# EAGLE design stm32F1_dev_schematic (EAGLE 9.6.2)
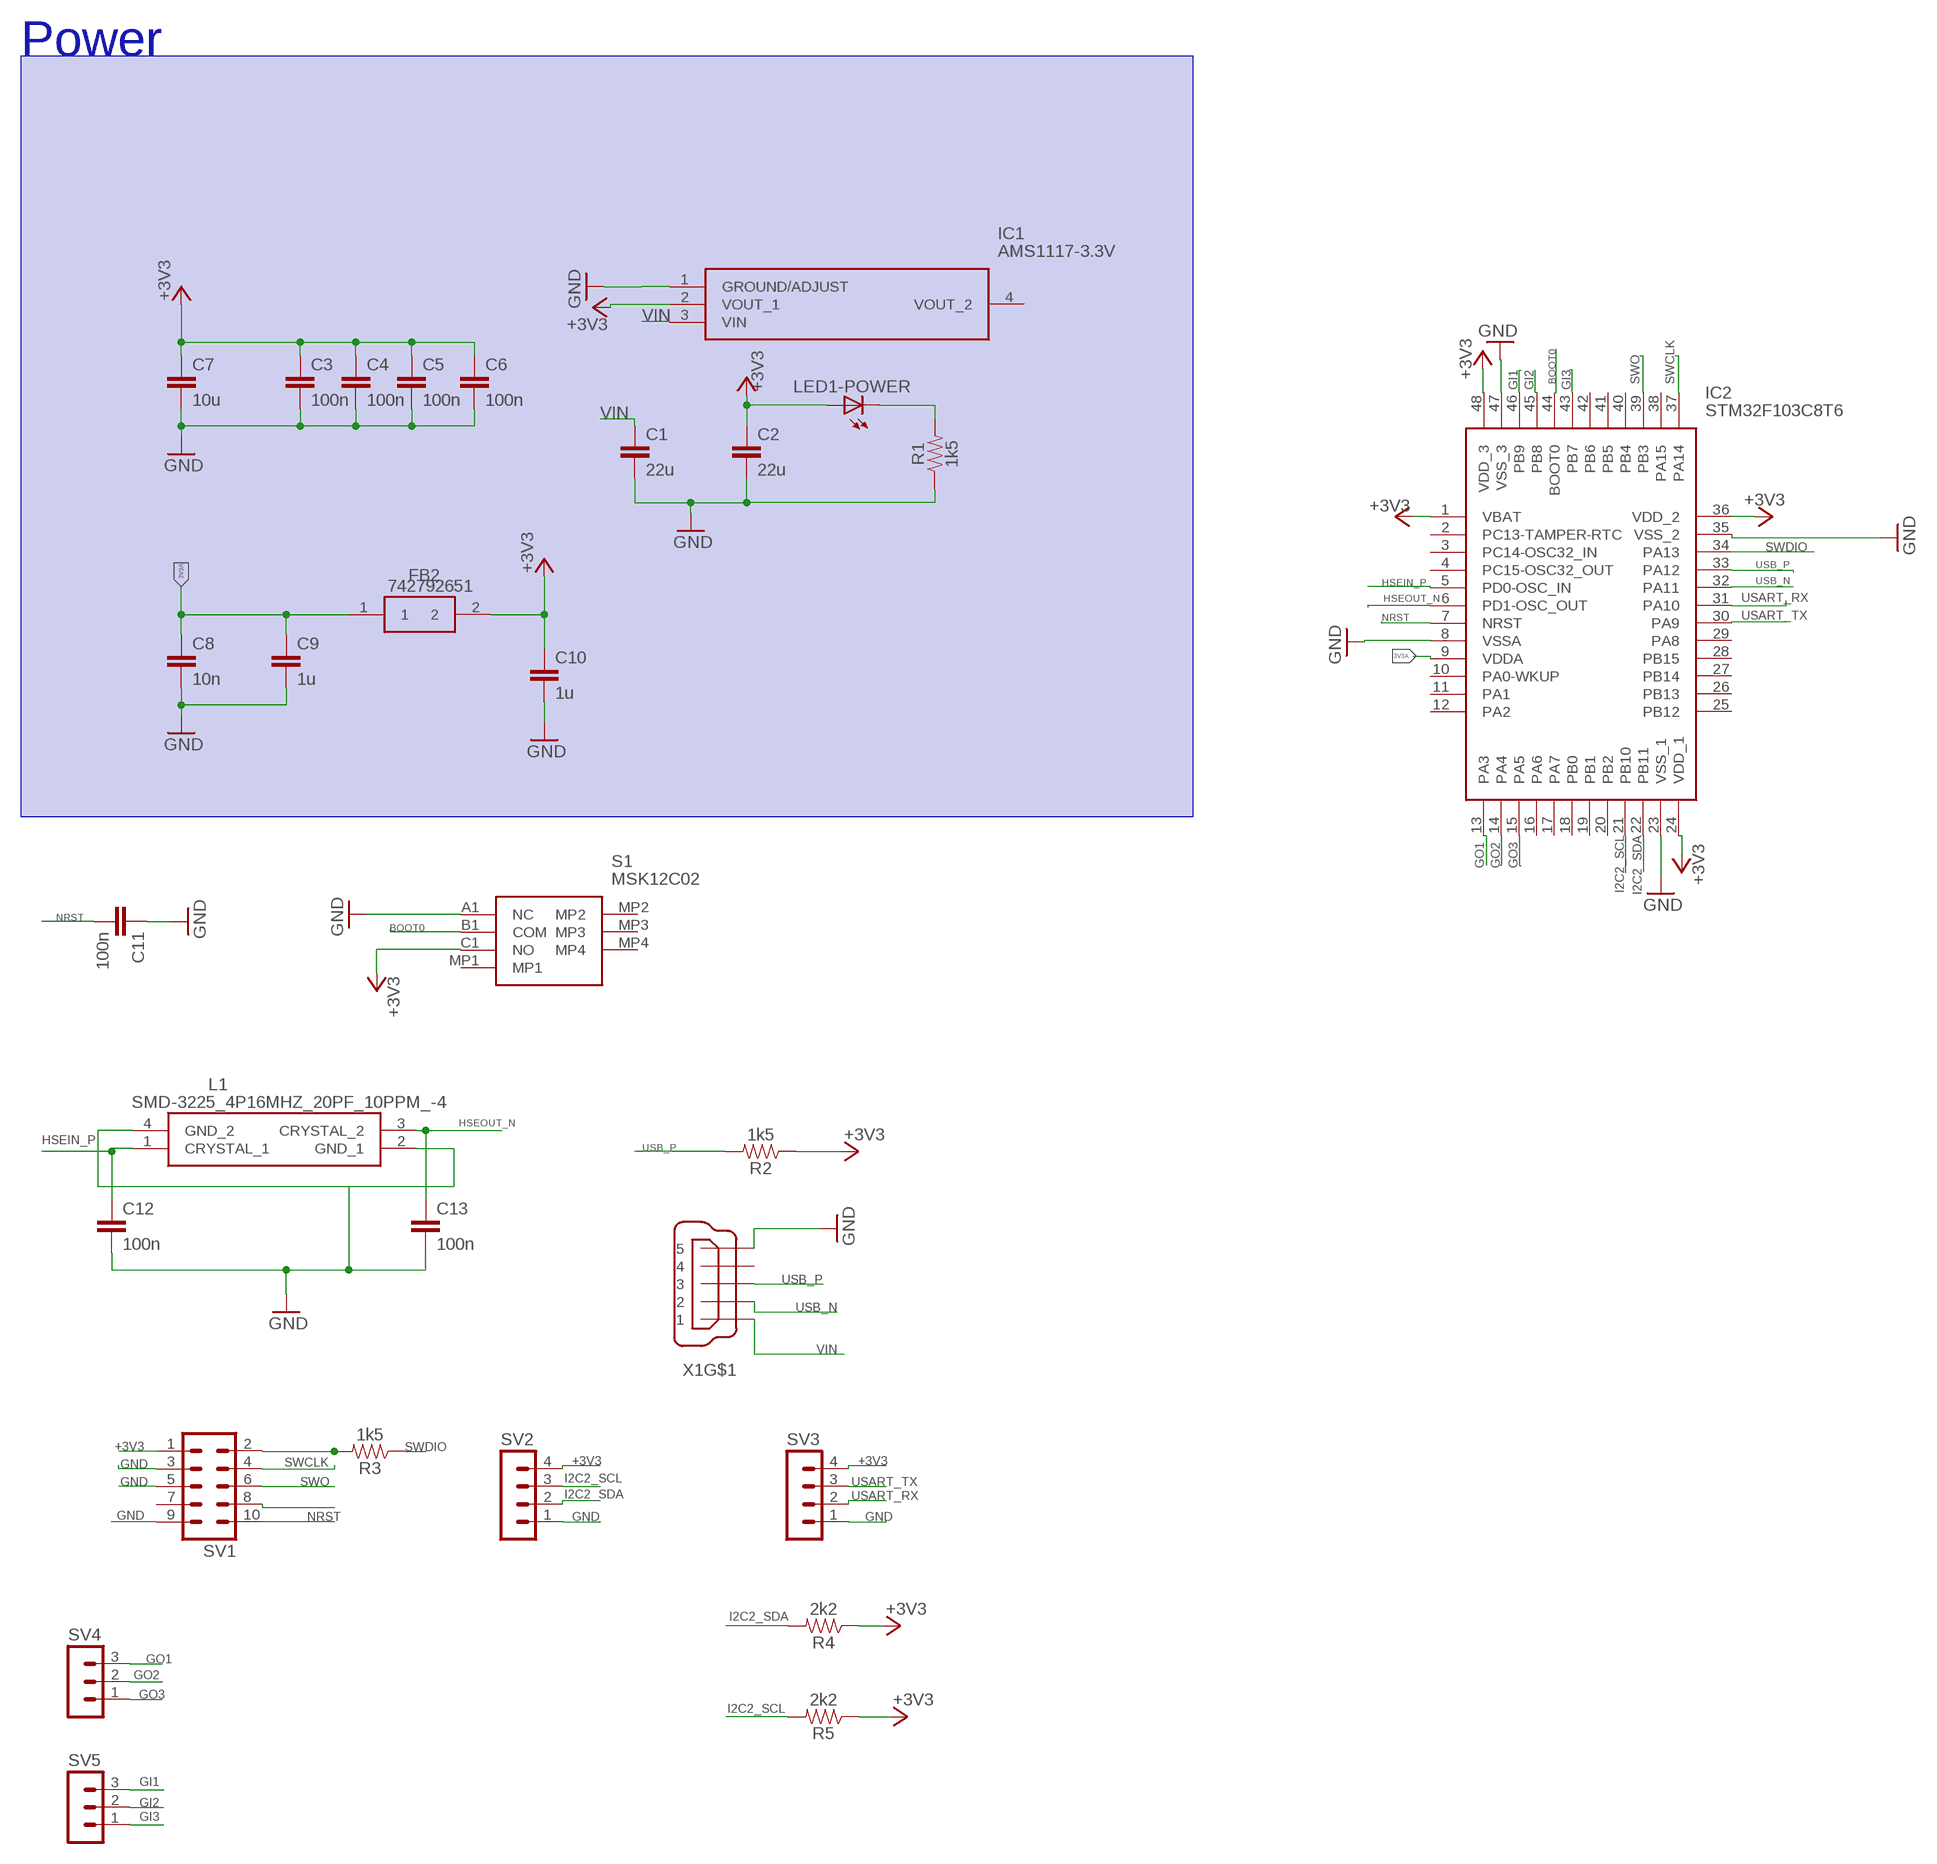
[diagram p0: schematic, sheet 1]

## Parts
C1  22u  1.0UF-0805-25V-(+80/-20%)  [0805]
C2  22u  1.0UF-0805-25V-(+80/-20%)  [0805]
C3  100n  1.0UF-0805-25V-(+80/-20%)  [0805]
C4  100n  1.0UF-0805-25V-(+80/-20%)  [0805]
C5  100n  1.0UF-0805-25V-(+80/-20%)  [0805]
C6  100n  1.0UF-0805-25V-(+80/-20%)  [0805]
C7  10u  1.0UF-0805-25V-(+80/-20%)  [0805]
C8  10n  1.0UF-0805-25V-(+80/-20%)  [0805]
C9  1u  1.0UF-0805-25V-(+80/-20%)  [0805]
C10  1u  1.0UF-0805-25V-(+80/-20%)  [0805]
C11  100n  1.0UF-0805-25V-(+80/-20%)  [0805]
C12  100n  1.0UF-0805-25V-(+80/-20%)  [0805]
C13  100n  1.0UF-0805-25V-(+80/-20%)  [0805]
FB2  742792651  [BEADC1608X100N]
IC1  AMS1117-3.3V  [SOT229P700X180-4N]
IC2  STM32F103C8T6  [QFP50P900X900X160-48N]
L1  SMD-3225_4P16MHZ_20PF_10PPM_-4  [SMD3225_4P16MHZ20PF10PPM4085]
LED1-POWER  LEDCHIPLED_0603  [CHIPLED_0603]
R1  1k5  0.22OHM-0805-1/4W-1%  [0805]
R2  1k5  0.22OHM-0805-1/4W-1%  [0805]
R3  1k5  0.22OHM-0805-1/4W-1%  [0805]
R4  2k2  0.22OHM-0805-1/4W-1%  [0805]
R5  2k2  0.22OHM-0805-1/4W-1%  [0805]
S1  MSK12C02  [MSK12C02]
SV1  MA05-2  [MA05-2]
SV2  MA04-1  [MA04-1]
SV3  MA04-1  [MA04-1]
SV4  MA03-1  [MA03-1]
SV5  MA03-1  [MA03-1]
X1  MINI-USB-SCHIELD-32005-301  [32005-301]

## Nets
3V3A: C8.1 C9.1 FB2.1 IC2.9(VDDA)
+3V3 [3v3]: C2.1 C3.1 C4.1 C5.1 C6.1 C7.1 C10.1 FB2.2 IC1.2(VOUT_1) IC2.1(VBAT) IC2.24(VDD_1) IC2.36(VDD_2) IC2.48(VDD_3) LED1-POWER.A R2.1 R4.1 R5.1 S1.C1(NO) SV1.1 SV2.4 SV3.4
BOOT0: IC2.44(BOOT0) S1.B1(COM)
GI1: IC2.46(PB9) SV5.3
GI2: IC2.45(PB8) SV5.2
GI3: IC2.43(PB7) SV5.1
GND: C1.2 C2.2 C3.2 C4.2 C5.2 C6.2 C7.2 C8.2 C9.2 C10.2 C11.1 C12.2 C13.2 IC1.1(GROUND/ADJUST) IC2.8(VSSA) IC2.23(VSS_1) IC2.35(VSS_2) IC2.47(VSS_3) L1.2(GND_1) L1.4(GND_2) R1.1 S1.A1(NC) SV1.3 SV1.5 SV1.9 SV2.1 SV3.1 X1.5
GO1: IC2.13(PA3) SV4.3
GO2: IC2.14(PA4) SV4.2
GO3: IC2.15(PA5) SV4.1
HSEIN_P: C12.1 IC2.5(PD0-OSC_IN) L1.1(CRYSTAL_1)
HSEOUT_N: C13.1 IC2.6(PD1-OSC_OUT) L1.3(CRYSTAL_2)
I2C2_SCL: IC2.21(PB10) R5.2 SV2.3
I2C2_SDA: IC2.22(PB11) R4.2 SV2.2
N$1: LED1-POWER.C R1.2
N$3: R3.2 SV1.2
N$6: SV1.8
NRST: C11.2 IC2.7(NRST) SV1.10
SWCLK: IC2.37(PA14) SV1.4
SWDIO: IC2.34(PA13) R3.1
SWO: IC2.39(PB3) SV1.6
USART_RX: IC2.31(PA10) SV3.2
USART_TX: IC2.30(PA9) SV3.3
USB_N: IC2.32(PA11) X1.2
USB_P: IC2.33(PA12) R2.2 X1.3
VIN [power in]: C1.1 IC1.3(VIN) X1.1
Unconnected: IC1.4(VOUT_2) IC2.2(PC13-TAMPER-RTC) IC2.3(PC14-OSC32_IN) IC2.4(PC15-OSC32_OUT) IC2.10(PA0-WKUP) IC2.11(PA1) IC2.12(PA2) IC2.16(PA6) IC2.17(PA7) IC2.18(PB0) IC2.19(PB1) IC2.20(PB2) IC2.25(PB12) IC2.26(PB13) IC2.27(PB14) IC2.28(PB15) IC2.29(PA8) IC2.38(PA15) IC2.40(PB4) IC2.41(PB5) IC2.42(PB6) S1.MP1 S1.MP2 S1.MP3 S1.MP4 SV1.7 X1.4 X1.M1(S:S1) X1.M2(S:S2) X1.M3(S:S3) X1.M4(S:S4)

## Notes on the sheet
- Power

## Library data of the parts
C1-C13 = SparkFun-Capacitors:1.0UF: 1µF ceramic capacitors A capacitor is a passive two-terminal electrical component used to store electrical energy temporarily in an electric field.; PROD_ID: CAP-11625; VALUE: 1.0uF
FB2 = ferrite bead:742792651: WE-CBF Ferrite Bead 0603 600Ohm 1000mA WE-CBF Ferrite Bead 0603 600Ohm 1000mA Source: Datasheet <https://datasheet.datasheetarchive.com/originals/distributors/Datasheets_SAMA/48062ffb9caf49acf8bdc538db0cfb17.pdf>; DESCRIPTION: WE-CBF Ferrite Bead 0603 600Ohm 1000mA WE-CBF Ferrite Bead 0603 600Ohm 1000mA; HEIGHT: 1mm; MANUFACTURER_NAME: Wurth Elektronik; MANUFACTURER_PART_NUMBER: 742792651; MOUSER_PART_NUMBER: 710-742792651; MOUSER_PRICE-STOCK: https://www.mouser.co.uk/ProductDetail/Wurth-Elektronik/742792651?qs=5twSNpOB8IDs0LGakhqBZQ%3D%3D
IC1 = ams1117-3.3v:AMS1117-3.3V: 1A LOW DROPOUT VOLTAGE REGULATOR, SOT-223 Source: Datasheet <http://www.advanced-monolithic.com/pdf/ds1117.pdf>; DESCRIPTION: 1A LOW DROPOUT VOLTAGE REGULATOR, SOT-223; HEIGHT: 1.8mm; MANUFACTURER_NAME: Advanced Monolithic Systems; MANUFACTURER_PART_NUMBER: ams1117-3.3v
IC2 = stm32f103c8t6:STM32F103C8T6: Mainstream Performance line, ARM Cortex-M3 MCU with 64 Kbytes Flash, 72 MHz CPU, motor control, USB and CAN Source: Datasheet <https://www.st.com/resource/en/datasheet/stm32f103c8.pdf>; ARROW_PART_NUMBER: STM32F103C8T6; ARROW_PRICE-STOCK: https://www.arrow.com/en/products/stm32f103c8t6/stmicroelectronics?region=nac; DESCRIPTION: Mainstream Performance line, ARM Cortex-M3 MCU with 64 Kbytes Flash, 72 MHz CPU, motor control, USB and CAN; HEIGHT: 1.6mm; MANUFACTURER_NAME: STMicroelectronics; MANUFACTURER_PART_NUMBER: stm32f103c8t6; MOUSER_PART_NUMBER: 511-STM32F103C8T6; MOUSER_PRICE-STOCK: https://www.mouser.co.uk/ProductDetail/STMicroelectronics/STM32F103C8T6?qs=bhCVus9SdFtq6kqxsU5%2FDA%3D%3D
L1 = SMD-3225_4p_clock:SMD-3225_4P16MHZ_20PF_10PPM_-4: SMD-3225_4P16MHZ 20PF 10PPM -40~+85 Source: Datasheet <https://datasheet.lcsc.com/szlcsc/Zhejiang-Abel-Elec-SMD-3225-4P-16MHz-20pF-10ppm-40-85_C164049.pdf>; DESCRIPTION: SMD-3225_4P16MHZ 20PF 10PPM -40~+85; HEIGHT: 0.8mm; MANUFACTURER_NAME: TAE(Zhejiang Abel Elec); MANUFACTURER_PART_NUMBER: SMD-3225_4P16MHZ 20PF 10PPM -40~+85℃
LED1-POWER = adafruit:LED: LED OSRAM: - CHIPLED LG R971, LG N971, LY N971, LG Q971, LY Q971, LO R971, LY R971 LH N974, LH R974 LS Q976, LO Q976, LY Q976 LO Q996 - Hyper CHIPLED LW Q18S LB Q993, LB Q99A, LB R99A - SideLED LS A670, LO A670, LY A670, LG A670, LP A670 LB A673, LV A673, LT A673, LW A673 LH A674 LY A675 LS A676, LA A676, LO A676, LY A676, LW A676 LS A679, LY A679, LG A679 - Hyper Micro SIDELED® LS Y876, LA Y876, LO Y876, LY Y876 LT Y87S - SmartLED LW L88C, LW L88S LB L89C, LB L89S, LG L890 LS L89K, LO L89K, LY L89K LS L896, LA L896, LO L896, LY L896 - TOPLED LS T670, LO T670, LY T670, LG T670, LP T670 LSG T670, LSP T670, LSY T670, LOP T670, LYG T670 LG T671, LOG T671, LSG T671 LB T673, LV T673, LT T673, LW T673 LH T674 LS T676, LA T676, LO T676, LY T676, LB T676, LH T676, LSB T676, LW T676 LB T67C, LV T67C, LT T67C, LS T67K, LO T67K, LY T67K, LW E67C LS E67B, LA E67B, LO E67B, LY E67B, LB E67C, LV E67C, LT E67C LW T67C LS T679, LY T679, LG T679 LS T770, LO T770, LY T770, LG T770, LP T770 LB T773, LV T773, LT T773, LW T773 LH T774 LS E675, LA E675, LY E675, LS T675 LS T776, LA T776, LO T776, LY T776, LB T776 LHGB T686 LT T68C, LB T68C - Hyper Mini TOPLED® LB M676 - Mini TOPLED Santana® LG M470 LS M47K, LO M47K, LY M47K Source: http://www.osram.convergy.de/
R1-R5 = SparkFun-Resistors:0.22OHM: 0.22Ω resistor A resistor is a passive two-terminal electrical component that implements electrical resistance as a circuit element. Resistors act to reduce current flow, and, at the same time, act to lower voltage levels within circuits. - Wikipedia; PROD_ID: RES-09883; VALUE: 0.22
S1 = MSK12C02 SPDT:MSK12C02: SMD Toggle Switches Source: Datasheet <https://shouhan.en.made-in-china.com/product/xsMEmqgOAXWB/China-Slide-Switch-Msk12c02-Slide-Switch-on-off-2-Position-1p2t-Spdt-Miniature-Horizontal-SMD-7p-Slide-Switch.html>; DESCRIPTION: SMD Toggle Switches; HEIGHT: 1.4mm; MANUFACTURER_NAME: Shou Han; MANUFACTURER_PART_NUMBER: MSK12C02
SV1 = con-lstb:MA05-2: PIN HEADER; OC_FARNELL: unknown; OC_NEWARK: unknown
SV2 SV3 = con-lstb:MA04-1: PIN HEADER; OC_FARNELL: unknown; OC_NEWARK: unknown
SV4 SV5 = con-lstb:MA03-1: PIN HEADER; OC_FARNELL: unknown; OC_NEWARK: unknown
X1 = con-cypressindustries:MINI-USB-SCHIELD-: MINI USB-B Conector Source: www.cypressindustries.com; OC_FARNELL: unknown; OC_NEWARK: unknown

## Net classes
1 3v3: width 0.229 mm

## Board
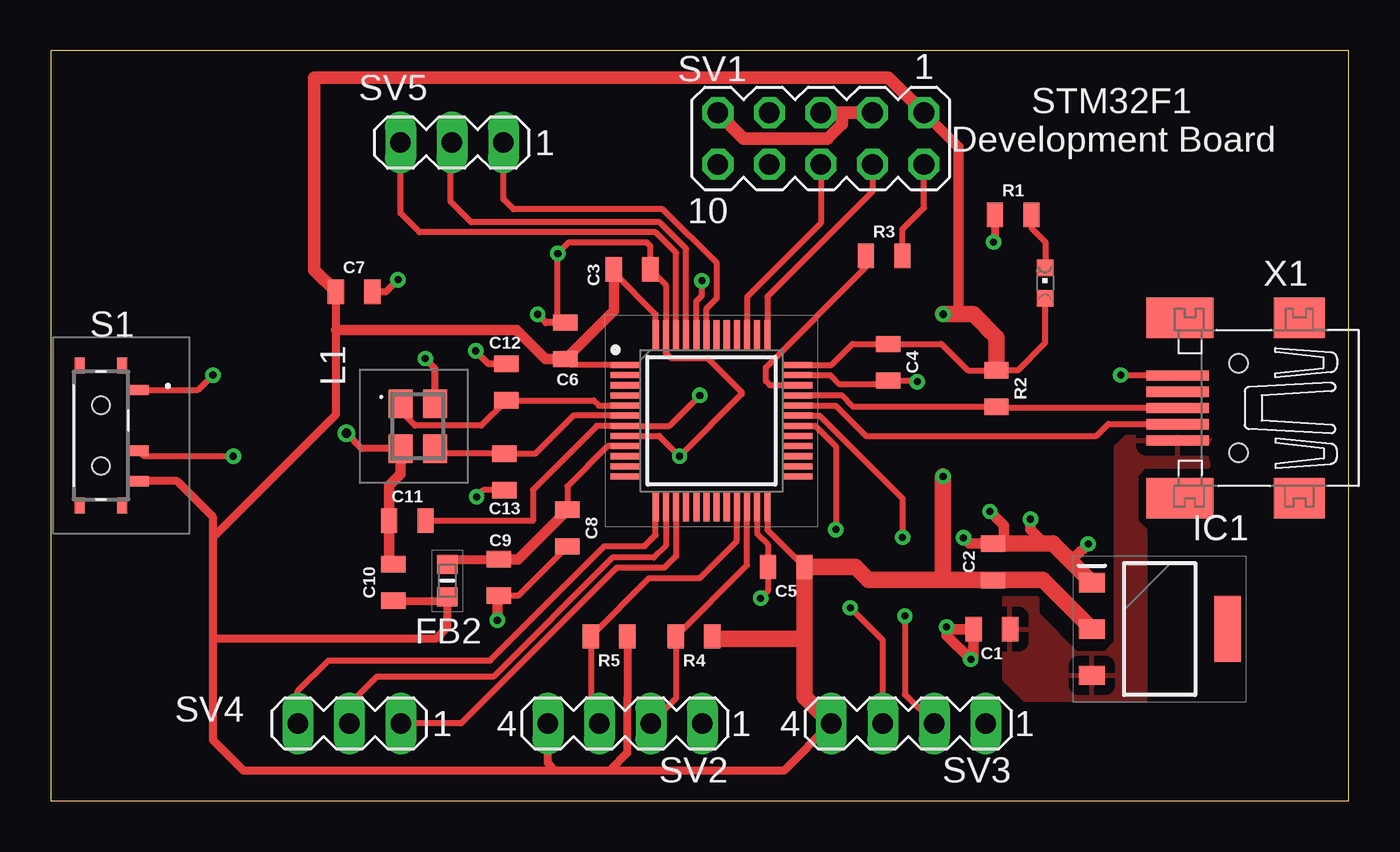
[diagram p1: board, top side]
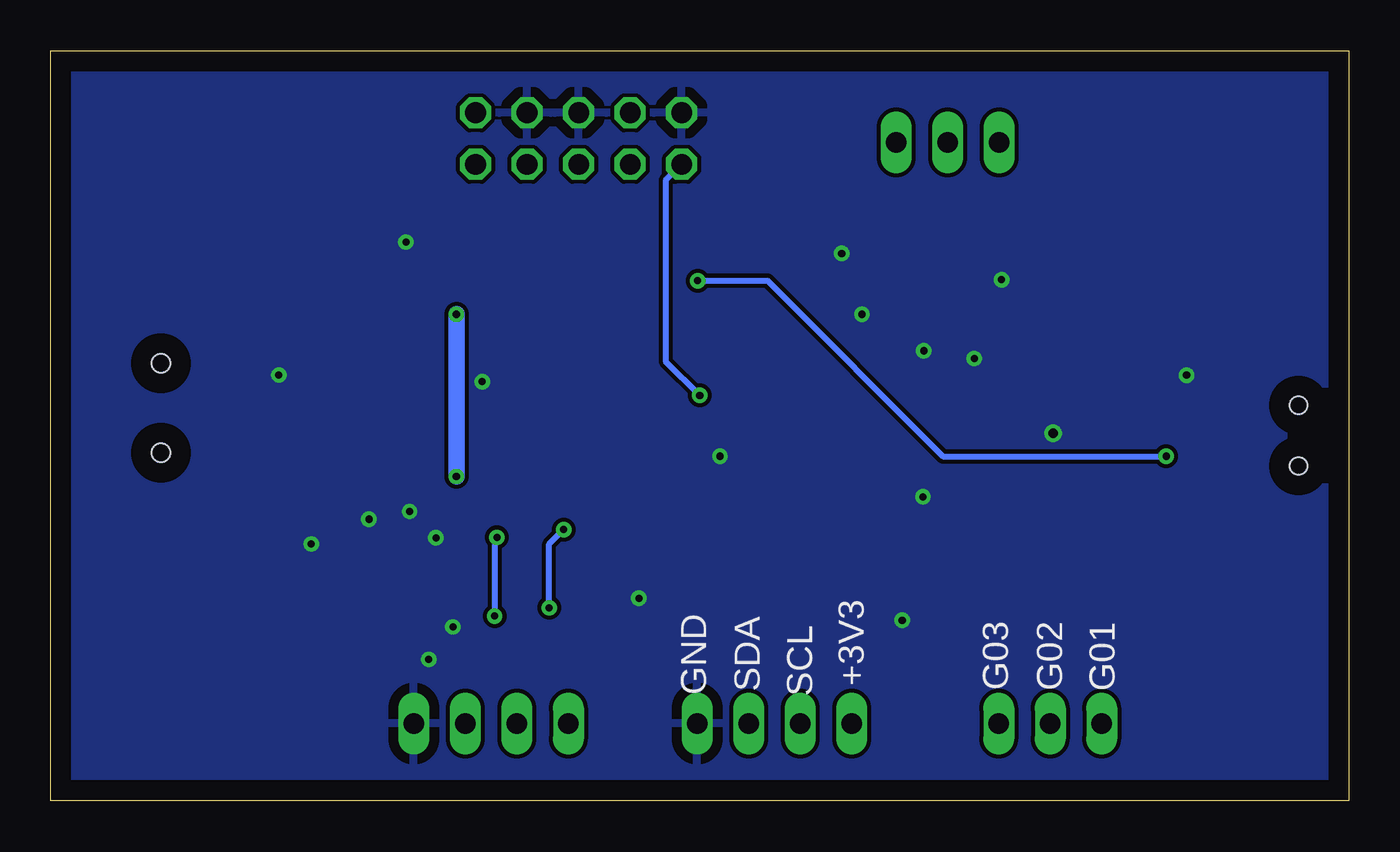
[diagram p2: board, bottom side, seen from below]

Size 64 x 37 mm. Coordinates in mm from the lower left corner, seen from the top.
Outline: 0,0 64,0 64,37 0,37 0,0
Copper layers (1*16): Top 0.035mm / dielectric 1.5mm / Bottom 0.035mm
Design rules "default *": minimum track width 0.3mm, minimum drill 0.35mm, track to track 0.2mm, track to pad 0.2mm, pad to pad 0.2mm, via to via 0.2mm, smd to smd 0.2mm, copper to edge 40mil, drill to drill 6mil, minimum pad ring 10mil, minimum via ring 8mil, stop-mask expansion 4mil, vias tented up to drill 0mil, thermal gap 0.5mm

### Footprints (pad centres in the part's own frame; a part is rotated, then mirrored left to right if it is on the bottom)
0805 = smd 0.8 x 1.2: 1 -0.9,0; 2 0.9,0
BEADC1608X100N = smd 0.95 x 1: 1 -0.8,0; 2 0.8,0
SOT229P700X180-4N = smd 1.3 x 0.95: 1 -3.35,2.29; 2 -3.35,0; 3 -3.35,-2.29 | smd 1.3 x 3.25: 4 3.35,0
QFP50P900X900X160-48N = smd 1.475 x 0.3: 1 -4.238,2.75; 2 -4.238,2.25; 3 -4.238,1.75; 4 -4.238,1.25; 5 -4.238,0.75; 6 -4.238,0.25; 7 -4.238,-0.25; 8 -4.238,-0.75; 9 -4.238,-1.25; 10 -4.238,-1.75; 11 -4.238,-2.25; 12 -4.238,-2.75; 25 4.238,-2.75; 26 4.238,-2.25; 27 4.238,-1.75; 28 4.238,-1.25; 29 4.238,-0.75; 30 4.238,-0.25; 31 4.238,0.25; 32 4.238,0.75; 33 4.238,1.25; 34 4.238,1.75; 35 4.238,2.25; 36 4.238,2.75 | smd 0.3 x 1.475: 13 -2.75,-4.238; 14 -2.25,-4.238; 15 -1.75,-4.238; 16 -1.25,-4.238; 17 -0.75,-4.238; 18 -0.25,-4.238; 19 0.25,-4.238; 20 0.75,-4.238; 21 1.25,-4.238; 22 1.75,-4.238; 23 2.25,-4.238; 24 2.75,-4.238; 37 2.75,4.238; 38 2.25,4.238; 39 1.75,4.238; 40 1.25,4.238; 41 0.75,4.238; 42 0.25,4.238; 43 -0.25,4.238; 44 -0.75,4.238; 45 -1.25,4.238; 46 -1.75,4.238; 47 -2.25,4.238; 48 -2.75,4.238
SMD3225_4P16MHZ20PF10PPM4085 = smd 1.4 x 1.2: 1 -1.1,-0.85; 2 1.1,-0.85; 3 1.1,0.85; 4 -1.1,0.85
CHIPLED_0603 = smd 0.8 x 0.8: A 0,-0.75; C 0,0.75
MSK12C02 = smd 0.5 x 1: A1 -2.25,1.85; B1 0.75,1.85; C1 2.25,1.85 | smd 0.8 x 0.5: MP1 3.45,1.05; MP2 3.45,-1.05; MP3 -3.45,-1.05; MP4 -3.45,1.05 | hole 0.85: -1.5,0; 1.5,0
MA05-2 = drill 1.016 octagon: 1 -5.08,-1.27; 2 -5.08,1.27; 3 -2.54,-1.27; 4 -2.54,1.27; 5 0,-1.27; 6 0,1.27; 7 2.54,-1.27; 8 2.54,1.27; 9 5.08,-1.27; 10 5.08,1.27
MA04-1 = drill 1.016 long: 1 -3.81,0; 2 -1.27,0; 3 1.27,0; 4 3.81,0
MA03-1 = drill 1.016 long: 1 -2.54,0; 2 0,0; 3 2.54,0
32005-301 = smd 3.1 x 0.5: 1 3,1.6; 2 3,0.8; 3 3,0; 4 3,-0.8; 5 3,-1.6 | smd 2.5 x 2: M1 -3,-4.45; M2 -3,4.45 | smd 3.3 x 2: M3 2.9,4.45; M4 2.9,-4.45 | hole 0.9: 0,2.2; 0,-2.2

### Placement (x,y rotation side)
C1  46.4,8.47 180 top
C2  46.47,11.79 90 top
C3  28.66,26.21 0 top
C4  41.3,21.64 270 top
C5  36.26,11.54 180 top
C6  25.37,22.69 90 top
C7  14.96,25.12 0 top
C8  25.48,13.46 270 top
C9  22.09,11.02 270 top
C10  16.9,10.78 90 top
C11  17.59,13.82 0 top
C12  22.46,20.66 90 top
C13  22.37,16.23 270 top
FB2  19.55,10.86 270 top
IC1  54.68,8.48 0 top
IC2  32.58,18.75 0 top
L1  18.1,18.48 270 top
LED1-POWER  49.03,25.54 0 top
R1  47.46,28.91 0 top
R2  46.63,20.34 270 top
R3  41.09,26.88 0 top
R4  31.72,8.12 180 top
R5  27.53,8.12 180 top
S1  2.48,18.02 270 top
SV1  37.97,32.67 180 top
SV2  28.32,3.82 180 top
SV3  42.29,3.82 180 top
SV4  14.72,3.82 180 top
SV5  19.78,32.47 180 top
X1  58.56,19.38 180 top

### Tracks (layer width: path | path; a pad name or v marks a point on that pad's centre or on a via)
3V3A
  Top 0.3: IC2.9 27.46,17.5 25.48,15.52 C8.1
  Top 0.45: FB2.1 19.81,11.92 C9.1
  Top 0.508: C8.1 23.04,11.92 C9.1
+3V3  (via drill 0.35)
  Top 0.3: IC2.36 38.5,21.5 39.54,22.54 C4.1 43.91,22.54 45.21,21.23 R2.1 47.68,21.24 49.03,22.59 LED1-POWER.A | IC2.24 35.33,13.38 C5.1 | IC2.1 25.66,21.5 C6.1 | IC2.48 29.83,23.99 27.76,26.06 C3.1
  Top 0.406: C10.1 19.37,9.88 FB2.2 19.55,8.55 19,8 8,8 | R5.1 28.43,5.07 28.43,2.36 27.56,1.5 | 27.56,1.5 24.89,1.5 | SV2.4 24.51,1.88 24.89,1.5 | SV3.4 36.16,1.5 27.56,1.5 | 24.89,1.5 9.5,1.5 8,3 8,8 | 8,8 8,13 | 8,13 8,14 6.23,15.77 S1.C1 | 8,13 14.06,19.06 14.06,23.22 C7.1
  Top 0.508: SV1.1 44.76,32.24 44.76,24 | 14.06,23.22 22.96,23.22 24.39,21.79 C6.1 27.76,24.18 C3.1
  Top 0.61: SV1.1 41.31,35.68 13,35.68 13,26.18 C7.1
  Top 0.813: IC1.2 48.92,10.89 C2.1 44,10.89 | 44,10.89 40.32,10.89 39.66,11.54 C5.1 37.16,8 | 37.16,8 37.16,5.14 SV3.4 | R4.1 32.74,8 37.16,8 | 44,10.89 v44,16 | v44,24 44.76,24 45.49,24 46.63,22.86 R2.1
  Bottom 0.813: v44,16 v44,24
BOOT0  (via drill 0.35)
  Top 0.3: IC2.44 31.83,24.64 32.11,24.92 v32.11,25.65
  Top 0.305: v9,17 4.6,17 S1.B1
  Bottom 0.305: v32.11,25.65 28.65,25.65 20,17 v9,17
GI1
  Top 0.3: IC2.46 30.83,27.03 29.82,28.04 18.19,28.04 17.24,28.99 SV5.3
GI2
  Top 0.3: IC2.45 31.33,27.24 30.03,28.54 20.73,28.54 19.71,29.57 19.71,32.4 SV5.2
GI3
  Top 0.3: SV5.1 22.32,29.67 22.81,29.18 30.18,29.18 32.84,26.52 | IC2.43 32.33,24.28 32.84,24.79
  Top 0.305: 32.84,24.79 32.84,26.52
GND  (via drill 0.35, 0.45)
  Top 0.3: IC2.35 38.44,21 38.86,20.57 41.13,20.57 C4.2 | IC2.23 34.83,13.17 35.36,12.64 C5.2 35.36,10.36 v35,10 | C8.2 23.04,10.12 C9.2 | C6.2 25,23.96 v25,27 25.54,27.54 29.39,27.54 29.56,27.37 C3.2 30.33,25.44 IC2.47 30.33,22.11 30.59,21.84 32.38,21.84 34.06,20.17 34.06,20.06 v31,17 30,18 IC2.8
  Top 0.305: X1.5 52.78,20.98 v52.76,21.01 | C4.2 42.66,20.74 v42.72,20.68 | C13.2 21.33,15.33 v21,15 | S1.A1 7.27,20.27 v8,21
  Top 0.35: C7.2 16.53,25.12 v17.12,25.7 | C6.2 24.41,23.59 v24,24 | C12.2 21.59,21.56 v20.95,22.2 | L1.4 18.95,21.33 v18.47,21.82 | L1.2 15.34,17.38 v14.58,18.14
  Top 0.406: R1.1 46.56,27.63 v46.48,27.56
  Top 0.508: C2.2 45.3,12.69 v45.01,12.98 | v46.3,14.28 47,13.58 47,12.69 | v48.31,13.89 48.31,13.38 49,12.69 | v51.16,12.68 50.53,12.05 50.05,12.05 | v22.02,8.91 22.02,10.06 C9.2 | C10.2 16.68,11.89 C11.1 16.68,15.57 17.25,16.13 L1.2 | C1.2 44.29,8.47 v44.17,8.59 44.17,8.18 v45.36,6.99 45.5,7.12 C1.2
  Top 0.61: SV1.5 39,33.94 | 39,33.94 SV1.3 | 39,33.94 39,33.36 38.3,32.67 34.17,32.67 SV1.9
  Top 0.813: IC1.1 50.05,12.05 49.41,12.69 49,12.69 47,12.69 C2.2
  pour Bottom: 0,38 65,38 67,36 67,-3 66,-4 -2,-4 -4,-2 -4,34
GO1
  Top 0.3: SV4.3 12.18,5.42 13.69,6.93 21.67,6.93 27.3,12.57 29.29,12.57 29.83,13.12 IC2.13
GO2
  Top 0.3: IC2.14 30.33,12.6 29.73,12 27.7,12 21.82,6.12 16.08,6.12 14.72,4.76 SV4.2
GO3
  Top 0.3: SV4.1 20.23,3.82 27.91,11.5 30.25,11.5 30.83,12.09 IC2.15
HSEIN_P
  Top 0.3: IC2.5 27.03,19.5 26.77,19.76 C12.1 21.22,18.52 17.96,18.52 17.25,19.22 L1.1
HSEOUT_N
  Top 0.3: IC2.6 25.77,19 23.89,17.12 C13.1 19.2,17.13 L1.3
I2C2_SCL
  Top 0.3: SV2.3 26.63,4.24 R5.2 29.51,11 32,11 33.83,12.83 IC2.21
I2C2_SDA
  Top 0.3: SV2.2 30.82,5.05 R4.2 34.33,11.63 IC2.22
N$1
  Top 0.3: R1.2 48.36,28.25 49.05,27.56 49.05,26.31 LED1-POWER.C
N$3
  Top 0.3: R3.2 41.99,28.2 43.05,29.26 SV1.2
NRST  (via drill 0.35)
  Top 0.3: C11.2 23.77,13.82 23.77,15.34 26.93,18.5 IC2.7 30.5,18.5 v32,20
  Bottom 0.3: v32,20 33.68,21.68 33.68,30.61 SV1.10
SWCLK
  Top 0.3: SV1.4 40.51,30.05 35.33,24.86 IC2.37
SWDIO
  Top 0.3: IC2.34 35.46,20.5 35.26,20.7 35.26,21.39 40.19,26.32 R3.1
SWO
  Top 0.3: SV1.6 37.97,28.5 34.33,24.86 IC2.39
USART_RX  (via drill 0.35)
  Top 0.3: IC2.31 37.91,19 42,14.91 v42,13 | v42.11,9.12 42.11,5.27 SV3.2
  Bottom 0.3: v42,13 42.11,12.89 v42.11,9.12
USART_TX  (via drill 0.35)
  Top 0.3: SV3.3 41.02,7.93 v39.42,9.53 | v38.71,13.39 38.71,17.49 37.7,18.5 IC2.30
  Bottom 0.3: v39.42,9.53 39.42,12.68 v38.71,13.39
USB_N
  Top 0.3: IC2.32 38.69,19.5 40.19,18 51.55,18 52.15,18.59 55.55,18.59 X1.2
USB_P
  Top 0.3: X1.3 46.68,19.38 R2.2 39.56,19.44 39,20 IC2.33
VIN
  pour Top: 47,10 47,6 48,5 52,5 54,5 54,13.34 53.54,13.79 53.54,16.08 53.95,16.48 57.07,16.48 57.3,16.71 57.3,17.83 57.18,17.96 53.01,17.96 52.7,17.65 52.5,17.45 52.5,14.38 52.5,7.82 51.97,7.29 50.57,7.29 48.79,9.07 48.67,9.19 48.67,9.98 47.02,9.98

### Text on the board
tNames: STM32F1 / Development Board
bNames: +3V3 | G01 | G02 | G03 | SCL | SDA | GND